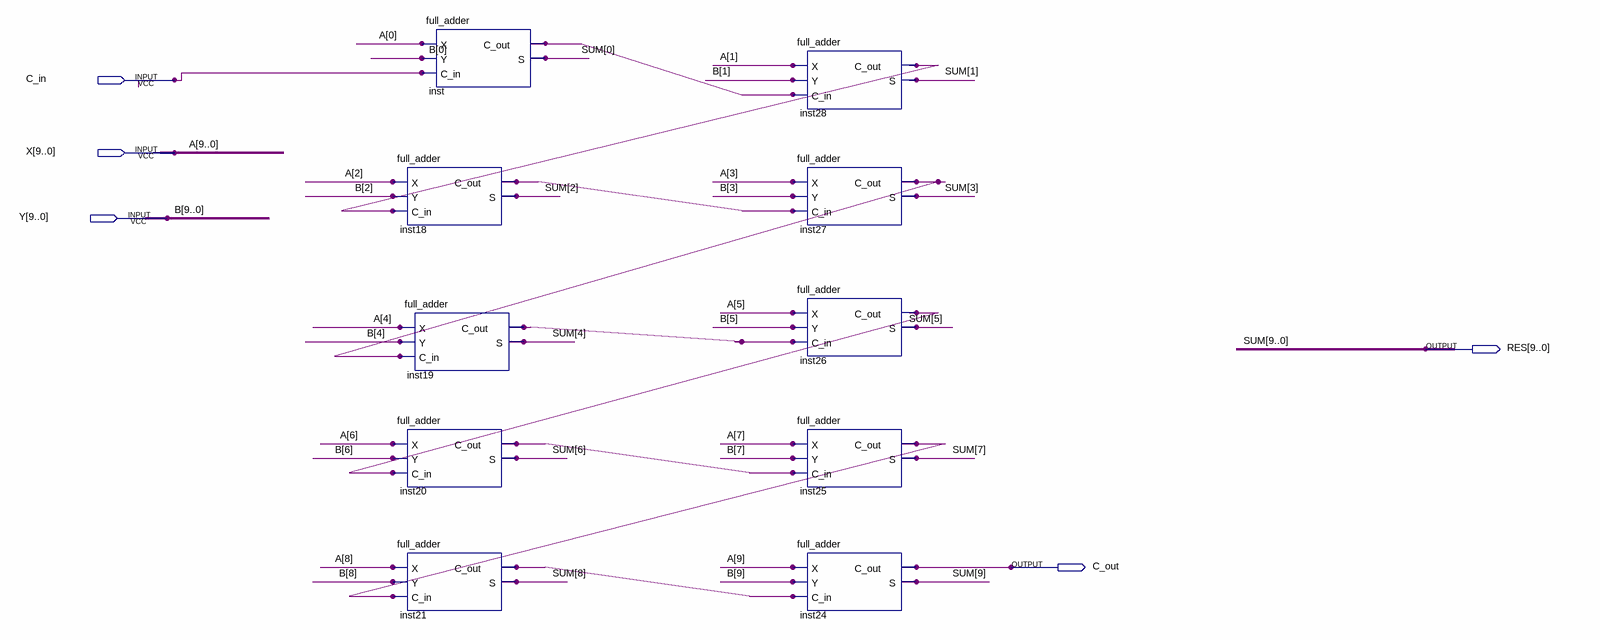
[diagram p0: schematic sheet]
// Quartus schematic ripple_carry_adder_bit.bdf as structural Verilog: 10 symbols, 5 pins
module ripple_carry_adder_bit (
  input  C_in,
  input  [9:0] X,
  input  [9:0] Y,
  output [9:0] RES,
  output C_out
);

  wire inst18_c_out, inst19_c_out, inst20_c_out, inst21_c_out, inst25_c_out, inst26_c_out, inst27_c_out,
       inst28_c_out, inst_c_out;

  full_adder inst (.X(X[0]), .Y(Y[0]), .C_in(C_in), .C_out(inst_c_out), .S(RES[0]));
  full_adder inst18 (.X(X[2]), .Y(Y[2]), .C_in(inst28_c_out), .C_out(inst18_c_out), .S(RES[2]));
  full_adder inst19 (.X(X[4]), .Y(Y[4]), .C_in(inst27_c_out), .C_out(inst19_c_out), .S(RES[4]));
  full_adder inst20 (.X(X[6]), .Y(Y[6]), .C_in(inst26_c_out), .C_out(inst20_c_out), .S(RES[6]));
  full_adder inst21 (.X(X[8]), .Y(Y[8]), .C_in(inst25_c_out), .C_out(inst21_c_out), .S(RES[8]));
  full_adder inst28 (.X(X[1]), .Y(Y[1]), .C_in(inst_c_out), .C_out(inst28_c_out), .S(RES[1]));
  full_adder inst27 (.X(X[3]), .Y(Y[3]), .C_in(inst18_c_out), .C_out(inst27_c_out), .S(RES[3]));
  full_adder inst26 (.X(X[5]), .Y(Y[5]), .C_in(inst19_c_out), .C_out(inst26_c_out), .S(RES[5]));
  full_adder inst25 (.X(X[7]), .Y(Y[7]), .C_in(inst20_c_out), .C_out(inst25_c_out), .S(RES[7]));
  full_adder inst24 (.X(X[9]), .Y(Y[9]), .C_in(inst21_c_out), .C_out(C_out), .S(RES[9]));

  // Other names for the same wires on the sheet: SUM[9:0] = RES; A[9:0] = X; B[9:0] = Y
endmodule
